# Altium schematic sheet IMU.SchDoc
size A; SheetNumber: 1; SheetTotal: 1
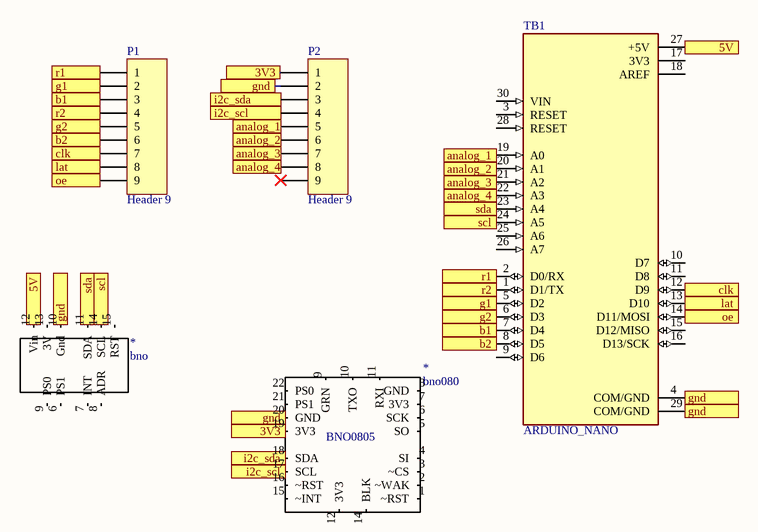
[diagram p0: IMU.SchDoc]

## Parts
(Parts that share a designator on the sheet are numbered #1, #2 ... from top to bottom, then left to right.)
*#1  bno  [BNO]
*#2  bno080  [bno080]
P1  Header 9  [HDR1X9]
P2  Header 9  [HDR1X9]
TB1  ARDUINO_NANO  [SHIELD_ARDUINO_NANO]

## Ports
3V3, 5V, analog_1, analog_2, analog_3, analog_4, b1, b2, clk, g1, g2, gnd, i2c_scl, i2c_sda, lat, oe, r1, r2, scl, sda

## Nets
3V3: *#2.19(3V3) P2.1 ; port 3V3
5V: *#1.12(Vin) TB1.27(+5V) ; port 5V
analog_1: P2.5 TB1.19(A0) ; port analog_1
analog_2: P2.6 TB1.20(A1) ; port analog_2
analog_3: P2.7 TB1.21(A2) ; port analog_3
analog_4: P2.8 TB1.22(A3) ; port analog_4
b1: P1.3 TB1.7(D4) ; port b1
b2: P1.6 TB1.8(D5) ; port b2
clk: P1.7 TB1.12(D9) ; port clk
g1: P1.2 TB1.5(D2) ; port g1
g2: P1.5 TB1.6(D3) ; port g2
gnd: *#1.10(Gnd) *#2.20(GND) P2.2 TB1.4(COM/GND) TB1.29(COM/GND) ; port gnd
i2c_scl: *#2.17(SCL) P2.4 ; port i2c_scl
i2c_sda: *#2.18(SDA) P2.3 ; port i2c_sda
lat: P1.8 TB1.13(D10) ; port lat
oe: P1.9 TB1.14(D11/MOSI) ; port oe
r1: P1.1 TB1.2(D0/RX) ; port r1
r2: P1.4 TB1.1(D1/TX) ; port r2
scl: *#1.14(SCL) TB1.24(A5) ; port scl
sda: *#1.11(SDA) TB1.23(A4) ; port sda

Not connected (* = marked no-connect by the designer): *#1 6(PS1) 7(INT) 8(ADR) 9(PS0) 13(3V) 15(RST); *#2 1(~RST) 2(~WAK) 3(~CS) 4(SI) 5(SO) 6(SCK) 7(3V3) 8(GND) 9(GRN) 10(TXO) 11(RXI) 12(3V3) 14(BLK) 15(~INT) 16(~RST) 21(PS1) 22(PS0); P2 9*; TB1 3(RESET) 9(D6) 10(D7) 11(D8) 15(D12/MISO) 16(D13/SCK) 17(3V3) 18(AREF) 25(A6) 26(A7) 28(RESET) 30(VIN)

## Notes on the sheet
- (in symbol bno080) BNO0805

## Library data of the parts
P1 P2 = Header 9: Header, 9-Pin; LatestRevisionDate: 17-Jul-2002; LatestRevisionNote: Re-released for DXP Platform.; Publisher: Altium Limited
TB1 = ARDUINO_NANO: Small, complete, and breadboard-friendly board based on the ATmega328 (Arduino Nano 3.x); Check_prices: https://www.snapeda.com/parts/Arduino%20Nano/Arduino/view-part/?ref=eda; Value: *; Availability: Not in stock; MP: Arduino Nano; Price: None; Package: Non-Standard Arduino; SnapEDA_Link: https://www.snapeda.com/parts/Arduino%20Nano/Arduino/view-part/?ref=snap; MF: Arduino